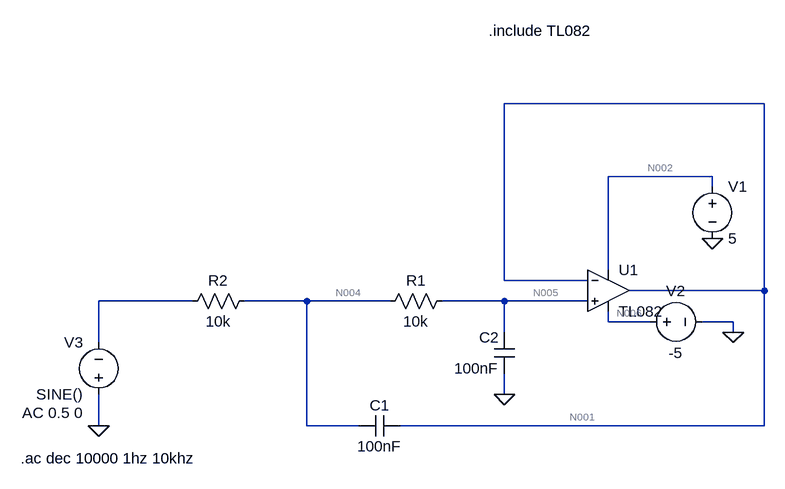
[diagram p0: schematic PasoBajo.asc]
PasoBajo.asc, the LTspice schematic file:
Version 4
SHEET 1 1044 948
WIRE 912 -176 512 -176
WIRE 832 -64 672 -64
WIRE 832 -48 832 -64
WIRE 672 80 672 -64
WIRE 512 96 512 -176
WIRE 640 96 512 96
WIRE 912 112 912 -176
WIRE 912 112 704 112
WIRE 32 128 -112 128
WIRE 208 128 112 128
WIRE 336 128 208 128
WIRE 512 128 416 128
WIRE 640 128 512 128
WIRE 672 160 672 144
WIRE 736 160 672 160
WIRE 864 160 816 160
WIRE 512 176 512 128
WIRE 864 176 864 160
WIRE -112 192 -112 128
WIRE 512 272 512 240
WIRE -112 320 -112 272
WIRE 208 320 208 128
WIRE 288 320 208 320
WIRE 912 320 912 112
WIRE 912 320 352 320
FLAG -112 320 0
FLAG 832 32 0
FLAG 864 176 0
FLAG 512 272 0
SYMBOL voltage -112 288 R180
WINDOW 0 24 96 Left 2
WINDOW 3 24 16 Left 2
WINDOW 123 24 -12 Left 2
WINDOW 39 0 0 Left 2
SYMATTR InstName V3
SYMATTR Value SINE()
SYMATTR Value2 AC 0.5 0
SYMBOL voltage 832 -64 R0
WINDOW 123 0 0 Left 2
WINDOW 39 0 0 Left 2
SYMATTR InstName V1
SYMATTR Value 5
SYMBOL voltage 720 160 R270
WINDOW 0 32 56 VTop 2
WINDOW 3 -32 56 VBottom 2
WINDOW 123 0 0 Left 2
WINDOW 39 0 0 Left 2
SYMATTR InstName V2
SYMATTR Value -5
SYMBOL Opamps\\opamp2 672 48 R0
SYMATTR InstName U1
SYMATTR Value TL082
SYMBOL cap 352 304 R90
WINDOW 0 0 32 VBottom 2
WINDOW 3 32 32 VTop 2
SYMATTR InstName C1
SYMATTR Value 100nF
SYMBOL cap 528 240 R180
WINDOW 0 24 56 Left 2
WINDOW 3 24 8 Left 2
SYMATTR InstName C2
SYMATTR Value 100nF
SYMBOL res 432 112 R90
WINDOW 0 0 56 VBottom 2
WINDOW 3 32 56 VTop 2
SYMATTR InstName R1
SYMATTR Value 10k
SYMBOL res 128 112 R90
WINDOW 0 0 56 VBottom 2
WINDOW 3 32 56 VTop 2
SYMATTR InstName R2
SYMATTR Value 10k
TEXT 488 -288 Left 2 !.include TL082
TEXT -232 370 Left 2 !.ac dec 10000 1hz 10khz

The netlist it stands for:
* PasoBajo.asc
V3 0 N003 SINE() AC 0.5 0
V1 N002 0 5
V2 N006 0 -5
XU1 N005 N001 N002 N006 N001 TL082  ; pins In+ In- V+ V- OUT
C1 N001 N004 100nF
C2 0 N005 100nF
R1 N005 N004 10k
R2 N004 N003 10k
.include TL082
.ac dec 10000 1hz 10khz
.backanno
.end

* Results of the author's LTspice run, read from the files saved beside the schematic
* Operating Point, zero values left out:
*   V(n002) = 5 V
*   V(n006) = -5 V
*   V(n001) = 10.27 µV
*   V(n005) = -701.1 nV
*   V(n004) = -350.5 nV
*   I(R2) = -35.05 pA
*   I(R1) = -35.05 pA
*   I(V2) = 4.862 mA
*   I(V1) = -4.861 mA
*   I(V3) = 35.05 pA
*   Ix(u1:1) = 35.05 pA
*   Ix(u1:2) = 35.05 pA
*   Ix(u1:3) = 4.861 mA
*   Ix(u1:4) = -4.862 mA
*   Ix(u1:5) = -35.05 pA